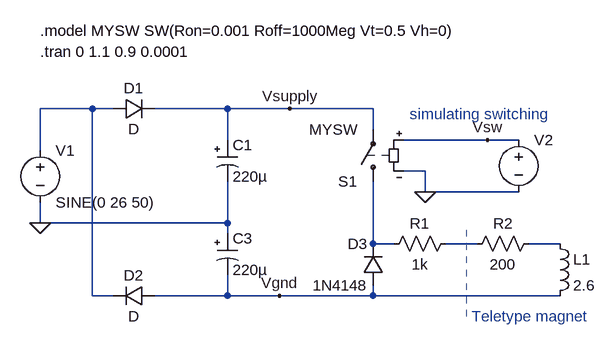
[diagram p0: schematic doubler.asc]
doubler.asc, the LTspice schematic file:
Version 4
SHEET 1 1120 680
WIRE 208 64 128 64
WIRE 240 64 208 64
WIRE 416 64 304 64
WIRE 512 64 416 64
WIRE 640 64 512 64
WIRE 640 96 640 64
WIRE 416 112 416 64
WIRE 816 112 688 112
WIRE 864 112 816 112
WIRE 128 128 128 64
WIRE 720 160 688 160
WIRE 720 192 720 160
WIRE 864 192 720 192
WIRE 128 240 128 208
WIRE 416 240 416 176
WIRE 416 240 128 240
WIRE 416 256 416 240
WIRE 640 272 640 176
WIRE 672 272 640 272
WIRE 800 272 752 272
WIRE 928 272 880 272
WIRE 208 352 208 64
WIRE 240 352 208 352
WIRE 416 352 416 320
WIRE 416 352 304 352
WIRE 496 352 416 352
WIRE 640 352 640 336
WIRE 640 352 496 352
WIRE 928 352 640 352
FLAG 128 240 0
FLAG 720 192 0
FLAG 512 64 Vsupply
FLAG 496 352 Vgnd
FLAG 816 112 Vsw
SYMBOL voltage 128 112 R0
WINDOW 123 0 0 Left 0
WINDOW 39 0 0 Left 0
SYMATTR InstName V1
SYMATTR Value SINE(0 26 50)
SYMBOL diode 240 80 R270
WINDOW 0 32 32 VTop 2
WINDOW 3 0 32 VBottom 2
SYMATTR InstName D1
SYMBOL diode 304 336 R90
WINDOW 0 0 32 VBottom 2
WINDOW 3 32 32 VTop 2
SYMATTR InstName D2
SYMBOL polcap 400 112 R0
WINDOW 3 24 56 Left 2
SYMATTR Value 220µ
SYMATTR InstName C1
SYMATTR Description Capacitor
SYMATTR Type cap
SYMATTR SpiceLine V=50 Irms=1.145 Rser=0.063 Lser=0 mfg="Chemi-Con" pn="LXF50VB221M10X25LL" type="Al electrolytic"
SYMBOL sw 640 192 R180
SYMATTR InstName S1
SYMATTR Value MYSW
SYMBOL voltage 864 96 R0
WINDOW 3 24 96 Invisible 2
WINDOW 123 0 0 Left 0
WINDOW 39 0 0 Left 0
SYMATTR Value PWL(0 1 1 1 1.001 0 1.019 0 1.02 1 1.039 1 1.04 0 1.079 0 1.08 1)
SYMATTR InstName V2
SYMBOL polcap 400 256 R0
SYMATTR InstName C3
SYMATTR Value 220µ
SYMATTR Description Capacitor
SYMATTR Type cap
SYMATTR SpiceLine V=50 Irms=1.145 Rser=0.063 Lser=0 mfg="Chemi-Con" pn="LXF50VB221M10X25LL" type="Al electrolytic"
SYMBOL ind 912 256 R0
SYMATTR InstName L1
SYMATTR Value 2.6
SYMBOL res 768 256 R90
WINDOW 0 0 56 VBottom 2
WINDOW 3 32 56 VTop 2
SYMATTR InstName R1
SYMATTR Value 1k
SYMBOL res 896 256 R90
WINDOW 0 0 56 VBottom 2
WINDOW 3 32 56 VTop 2
SYMATTR InstName R2
SYMATTR Value 200
SYMBOL diode 656 336 R180
WINDOW 0 24 64 Left 2
WINDOW 3 24 0 Left 2
SYMATTR InstName D3
SYMATTR Value 1N4148
TEXT 128 -24 Left 2 !.tran 0 1.1 0.9 0.0001
TEXT 128 -56 Left 2 !.model MYSW SW(Ron=0.001 Roff=1000Meg Vt=0.5 Vh=0)
TEXT 696 72 Left 2 ;simulating switching
TEXT 792 384 Left 2 ;Teletype magnet
LINE Normal 784 384 784 240 2

The netlist it stands for:
* doubler.asc
V1 N001 0 SINE(0 26 50)
D1 N001 Vsupply D
D2 Vgnd N001 D
C1 Vsupply 0 220µ V=50 Irms=1.145 Rser=0.063 Lser=0 mfg="Chemi-Con" pn="LXF50VB221M10X25LL" type="Al electrolytic"
S1 N002 Vsupply Vsw 0 MYSW
V2 Vsw 0 PWL(0 1 1 1 1.001 0 1.019 0 1.02 1 1.039 1 1.04 0 1.079 0 1.08 1)
C3 0 Vgnd 220µ V=50 Irms=1.145 Rser=0.063 Lser=0 mfg="Chemi-Con" pn="LXF50VB221M10X25LL" type="Al electrolytic"
L1 N004 Vgnd 2.6
R1 N003 N002 1k
R2 N004 N003 200
D3 Vgnd N002 1N4148
.model D D
.lib standard.dio
.tran 0 1.1 0.9 0.0001
.model MYSW SW(Ron=0.001 Roff=1000Meg Vt=0.5 Vh=0)
* simulating switching
* Teletype magnet
.backanno
.end